# EAGLE schematic aqc-dac-io-board (EAGLE 6.1)
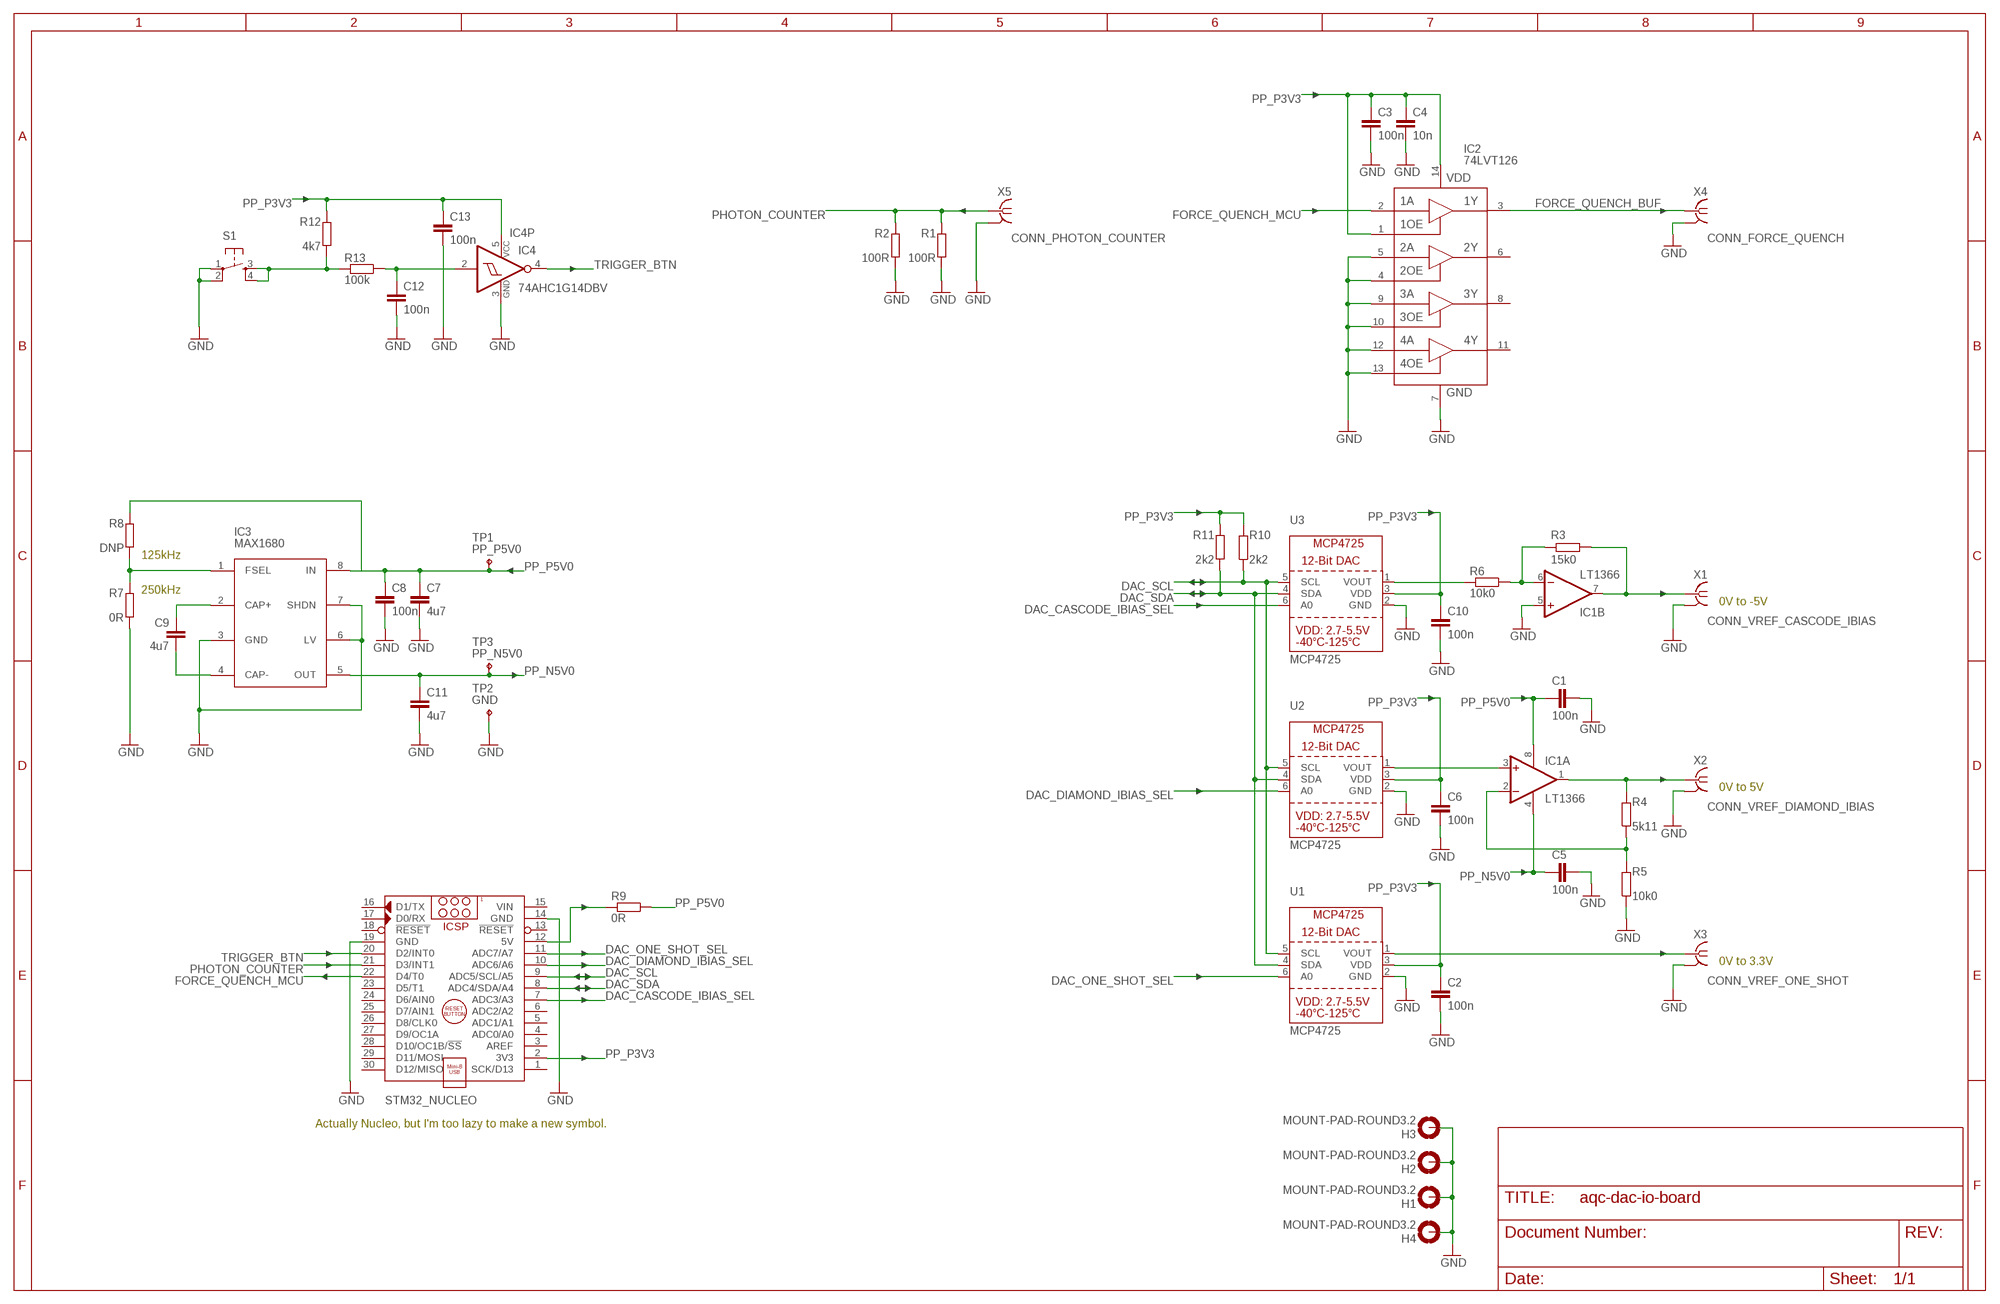
[diagram p0: schematic, sheet 1]

## Parts
C1  100n  C-EUC0603  [C0603]
C2  100n  C-EUC0603  [C0603]
C3  100n  C-EUC0603  [C0603]
C4  10n  C-EUC0603  [C0603]
C5  100n  C-EUC0603  [C0603]
C6  100n  C-EUC0603  [C0603]
C7  4u7  C-EUC0805  [C0805]
C8  100n  C-EUC0603  [C0603]
C9  4u7  C-EUC0805  [C0805]
C10  100n  C-EUC0603  [C0603]
C11  4u7  C-EUC0805  [C0805]
C12  100n  C-EUC0603  [C0603]
C13  100n  C-EUC0603  [C0603]
H1  MOUNT-PAD-ROUND3.2  [3,2-PAD]
H2  MOUNT-PAD-ROUND3.2  [3,2-PAD]
H3  MOUNT-PAD-ROUND3.2  [3,2-PAD]
H4  MOUNT-PAD-ROUND3.2  [3,2-PAD]
IC1  LT1366  [SO08]
IC2  74LVT126  [SO14]
IC3  MAX1680  MAX1680/1  [SO8]
IC4  74AHC1G14DBV  [SOT23-5]
R1  100R  R-EU_R0603  [R0603]
R2  100R  R-EU_R0603  [R0603]
R3  15k0  R-EU_R0603  [R0603]
R4  5k11  R-EU_R0603  [R0603]
R5  10k0  R-EU_R0603  [R0603]
R6  10k0  R-EU_R0603  [R0603]
R7  0R  R-EU_R0603  [R0603]
R8  DNP  R-EU_R0603  [R0603]
R9  0R  R-EU_R0603  [R0603]
R10  2k2  R-EU_R0603  [R0603]
R11  2k2  R-EU_R0603  [R0603]
R12  4k7  R-EU_R0603  [R0603]
R13  100k  R-EU_R0603  [R0603]
S1  TAC_SWITCHPTH  [TACTILE-PTH]
STM32_NUCLEO  ARDUINO_NANO  [ARDUINO_NANO]
TP1  PP_P5V0  KEYSTONE_5000  [KEYSTONE_5000_MINIATURE]
TP2  GND  KEYSTONE_5000  [KEYSTONE_5000_MINIATURE]
TP3  PP_N5V0  KEYSTONE_5000  [KEYSTONE_5000_MINIATURE]
U1  MCP4725  DAC_MCP4725  [SOT23-6]
U2  MCP4725  DAC_MCP4725  [SOT23-6]
U3  MCP4725  DAC_MCP4725  [SOT23-6]
X1  CONN_VREF_CASCODE_IBIAS  SMA-142-0701-801/806  [J502-ND-142-0701-801/806]
X2  CONN_VREF_DIAMOND_IBIAS  SMA-142-0701-801/806  [J502-ND-142-0701-801/806]
X3  CONN_VREF_ONE_SHOT  SMA-142-0701-801/806  [J502-ND-142-0701-801/806]
X4  CONN_FORCE_QUENCH  SMA-142-0701-801/806  [J502-ND-142-0701-801/806]
X5  CONN_PHOTON_COUNTER  SMA-142-0701-801/806  [J502-ND-142-0701-801/806]

## Nets
DAC_CASCODE_IBIAS_SEL: STM32_NUCLEO.7(ADC3/A3) U3.6(A0)
DAC_DIAMOND_IBIAS_SEL: STM32_NUCLEO.10(ADC6/A6) U2.6(A0)
DAC_ONE_SHOT_SEL: STM32_NUCLEO.11(ADC7/A7) U1.6(A0)
DAC_SCL: R10.1 STM32_NUCLEO.9(ADC5/SCL/A5) U1.5(SCL) U2.5(SCL) U3.5(SCL)
DAC_SDA: R11.1 STM32_NUCLEO.8(ADC4/SDA/A4) U1.4(SDA) U2.4(SDA) U3.4(SDA)
FORCE_QUENCH_BUF: IC2.3(1Y) X4.1
FORCE_QUENCH_MCU: IC2.2(1A) STM32_NUCLEO.22(D4/T0)
GND: C1.2 C2.2 C3.2 C4.2 C5.2 C6.2 C7.2 C8.2 C10.2 C11.2 C12.2 C13.2 H1.B3,2(MOUNT) H2.B3,2(MOUNT) H3.B3,2(MOUNT) H4.B3,2(MOUNT) IC1.5(B:+IN) IC2.4(2OE) IC2.5(2A) IC2.7(GND) IC2.9(3A) IC2.10(3OE) IC2.12(4A) IC2.13(4OE) IC3.3(GND) IC3.6(LV) IC3.7(SHDN) IC4.3(GND) R1.1 R2.1 R5.1 R7.1 S1.1 S1.2 STM32_NUCLEO.14(GND) STM32_NUCLEO.19(GND) TP2.P$1 U1.2(GND) U2.2(GND) U3.2(GND) X1.G@1(GND) X2.G@1(GND) X3.G@1(GND) X4.G@1(GND) X5.G@1(GND)
N$1: U1.1(VOUT) X3.1
N$2: R6.2 U3.1(VOUT)
N$3: IC1.6(B:-IN) R3.2 R6.1
N$4: IC3.1(FSEL) R7.2 R8.1
N$5: IC1.7(B:OUT) R3.1 X1.1
N$6: IC1.3(A:+IN) U2.1(VOUT)
N$7: IC1.1(A:OUT) R4.2 X2.1
N$8: IC1.2(A:-IN) R4.1 R5.2
N$9: R9.2 STM32_NUCLEO.12(5V)
N$11: R12.1 R13.2 S1.3 S1.4
N$12: C12.1 IC4.2(I) R13.1
N$14: C9.2 IC3.4(CAP-)
N$15: C9.1 IC3.2(CAP+)
PHOTON_COUNTER: R1.2 R2.2 STM32_NUCLEO.21(D3/INT1) X5.1
PP_N5V0: C5.1 C11.1 IC1.4(A:V-) IC3.5(OUT) TP3.P$1
PP_P3V3: C2.1 C3.1 C4.1 C6.1 C10.1 C13.1 IC2.1(1OE) IC2.14(VDD) IC4.5(VCC) R10.2 R11.2 R12.2 STM32_NUCLEO.2(3V3) U1.3(VDD) U2.3(VDD) U3.3(VDD)
PP_P5V0: C1.1 C7.1 C8.1 IC1.8(A:V+) IC3.8(IN) R8.2 R9.1 TP1.P$1
TRIGGER_BTN: IC4.4(O) STM32_NUCLEO.20(D2/INT0)
Unconnected: IC2.6(2Y) IC2.8(3Y) IC2.11(4Y) STM32_NUCLEO.1(SCK/D13) STM32_NUCLEO.3(AREF) STM32_NUCLEO.4(ADC0/A0) STM32_NUCLEO.5(ADC1/A1) STM32_NUCLEO.6(ADC2/A2) STM32_NUCLEO.13(!RESET) STM32_NUCLEO.16(D1/TX) STM32_NUCLEO.17(D0/RX) STM32_NUCLEO.18(!RESET) STM32_NUCLEO.23(D5/T1) STM32_NUCLEO.24(D6/AIN0) STM32_NUCLEO.25(D7/AIN1) STM32_NUCLEO.26(D8/CLK0) STM32_NUCLEO.27(D9/OC1A) STM32_NUCLEO.28(D10/OC1B/!SS) STM32_NUCLEO.29(D11/MOSI) STM32_NUCLEO.30(D12/MISO)

## Notes on the sheet
- 125kHz
- 250kHz
- 0V to -5V
- 0V to 5V
- 0V to 3.3V
- Actually Nucleo, but I'm too lazy to make a new symbol.

## Power pins joined to a net without a drawn wire
GND: X1.G@2(GND) X1.G@3(GND) X1.G@4(GND) X2.G@2(GND) X2.G@3(GND) X2.G@4(GND) X3.G@2(GND) X3.G@3(GND) X3.G@4(GND) X4.G@2(GND) X4.G@3(GND) X4.G@4(GND) X5.G@2(GND) X5.G@3(GND) X5.G@4(GND)
VIN: STM32_NUCLEO.15(VIN)

## Library data of the parts
C1-C13 = rcl:C-EU: CAPACITOR, European symbol
H1-H4 = holes:MOUNT-PAD-ROUND: MOUNTING PAD, round
IC1 = meng:LT1366: Dual Rail-Rail Opamp
IC2 = meng:74LVT126
IC3 = Kramnik's Library:MAX1680/1: 125mA, Frequency-Selectable, Switched-Capacitor Voltage Converter Digikey: http://www.digikey.com/product-detail/en/MAX1681ESA%2B/MAX1681ESA%2B-ND/947772
IC4 = 74xx-little-us:74*1G14: Single Schmitt-Trigger Inverter Gate
R1-R13 = resistor:R-EU_: RESISTOR, European symbol
S1 = Kramnik's Library:TAC_SWITCH: Momentary Switch Button commonly used for reset or general input. Spark Fun Electronics SKU : COM-00097 SMT- SWCH-08247
STM32_NUCLEO = ArduinoNanoV30:ARDUINO_NANO: Arduino Nano V3.0 Module Overview: The Arduino Nano is a small, complete, and breadboard-friendly board based on the ATmega328 (Arduino Nano 3.x) or ATmega168 (Arduino Nano 2.x). It has more or less the same functionality of the Arduino Duemilanove, but in a different package. It lacks only a DC power jack, and works with a Mini-B USB cable instead of a standard one. The Nano was designed and is being produced by Gravitech <http://www.gravitech.us/arna30wiatp.html>. General specifications: Item Value Microcontroller Atmel ATmega168 or ATmega328 Operating Voltage (logic level) 5 V Input Voltage (recommended) 7-12 V Input Voltage (limits) 6-20 V Digital I/O Pins 14 (of which 6 provide PWM output) Analog Input Pins 8 DC Current per I/O Pin 40 mA Flash Memory 16 KB (ATmega168) or 32 KB (ATmega328) of which 2 KB used by bootloader SRAM 1 KB (ATmega168) or 2 KB (ATmega328) EEPROM 512 bytes (ATmega168) or 1 KB (ATmega328) Clock Speed 16 MHz Dimensions (Inches) 0.73" x 1.70" Dimensions (mm) 18mm x 45mm Overall height About 9 mm (not including pins) Weigth 5 g Power: The Arduino Nano can be powered via the Mini-B USB connection, 6-20V unregulated external power supply (pin 30), or 5V regulated external power supply (pin 27). The power source is automatically selected to the highest voltage source. Memory: The ATmega168 has 16 KB of flash memory for storing code (of which 2 KB is used for the bootloader); the ATmega328 has 32 KB, (also with 2 KB used for the bootloader). The ATmega168 has 1 KB of SRAM and 512 bytes of EEPROM (which can be read and written with the EEPROM library); the ATmega328 has 2 KB of SRAM and 1 KB of EEPROM. Input and Output: Each of the 14 digital pins on the Nano can be used as an input or output, using pinMode(), digitalWrite(), and digitalRead() functions. They operate at 5 volts. Each pin can provide or receive a maximum of 40 mA and has an internal pull-up resistor (disconnected by default) of 20-50 kOhms. In addition, some pins have specialized functions. Visit Arduino - ArduinoBoardNano <https://www.arduino.cc/en/Main/ArduinoBoardNano>
TP1-TP3 = Kramnik's Library:KEYSTONE_5000
U1-U3 = microbuilder:DAC_MCP4725: MCP4725 - 12-Bit I2C DAC with on-board EEPROM Settling Time: 6 µs 2.7-5.5V Supply 100kHz, 400kHz, 3.4 Mbps I²C EEPROM can be used to store a specific output voltage which will be set coming out of reset I²C Address: 1100 A2 A1 A0 A0 is set via the A0 pin, A2 and A1 are hard-wired on the chip depending on the model chosen: Part Number A2 A1 Code MCP4725A0T-E/CH 0 0 AJNN MCP4725A1T-E/CH 0 1 APNN MCP4725A2T-E/CH 1 0 AQNN MCP4725A3T-E/CH 1 1 ARNN
X1-X5 = con-coax:SMA-: SMA 50 Ohm End Launch Jack Receptacle - Round Contact Johnson Components Source: www.johnsoncomponents.com .. J502-ND.pdf; MF: JOHNSON COMPONENTS; MPN: 142-0701-801; OC_FARNELL: 1608592; OC_NEWARK: 90F2624

## Net classes
1 100OHM_DIFF: width 0.254 mm, clearance 0.254 mm